# Altium schematic sheet Communication and peripherals.SchDoc
size A4
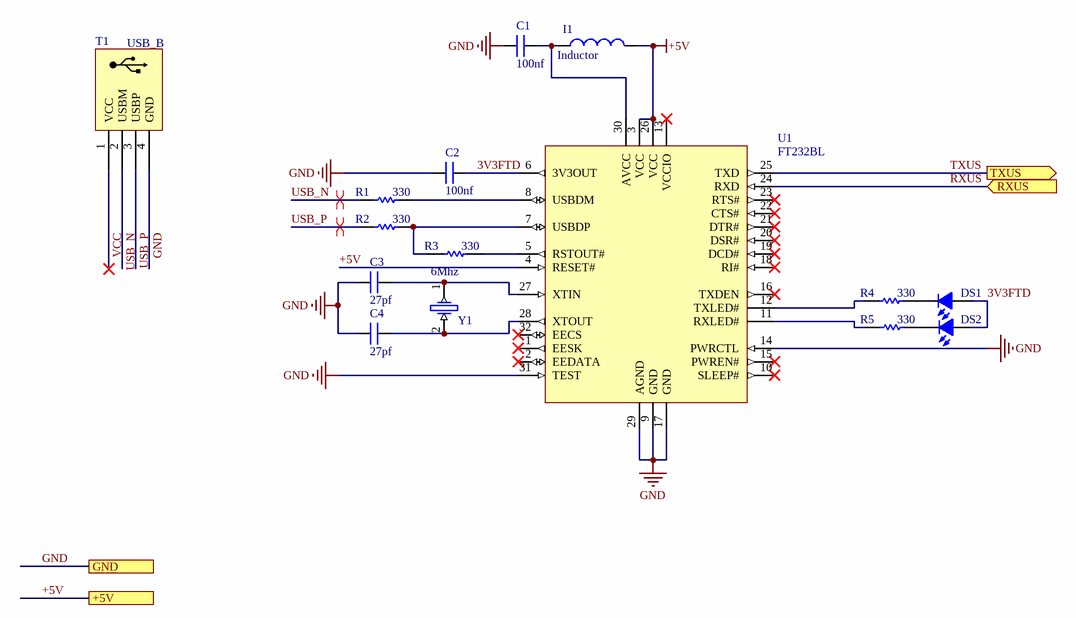
[diagram p0: Communication and peripherals.SchDoc]

## Parts
C1  100nf  [Cap0805]
C2  100nf  [Cap0805]
C3  27pf  [Cap0805]
C4  27pf  [Cap0805]
DS1  LED  [Led0805]  (value not drawn)
DS2  LED  [Led0805]  (value not drawn)
I1  Inductor  [1206]
R1  330  [R0805]
R2  330  [R0805]
R3  330  [R0805]
R4  330  [R0805]
R5  330  [R0805]
T1  USB_B  [USB_Dip_R]
U1  FT232BL  [LQFP-32_L]
Y1  6Mhz  [CrystallB]

## Ports
+5V, GND, RXUS (in), TXUS (out)

## Nets
+5V: I1.2 U1.3(VCC) U1.4(RESET#) U1.26(VCC) ; port +5V
GND: C1.2 C2.2 C3.1 C4.1 T1.4(GND) U1.9(GND) U1.14(PWRCTL) U1.17(GND) U1.29(AGND) U1.31(TEST) ; port GND
3V3FTD: C2.1 DS1.A DS2.A U1.6(3V3OUT)
RXUS: U1.24(RXD) ; port RXUS
TXUS: U1.25(TXD) ; port TXUS
USB_N: R1.1 T1.2(USBM)
USB_P: R2.1 T1.3(USBP)
VCC: T1.1(VCC)
NetC1_1: C1.1 I1.1 U1.30(AVCC)
NetC3_2: C3.2 U1.27(XTIN) Y1.1
NetC4_2: C4.2 U1.28(XTOUT) Y1.2
NetDS1_K: DS1.K R4.2
NetDS2_K: DS2.K R5.2
NetR1_2: R1.2 U1.8(USBDM)
NetR2_2: R2.2 R3.1 U1.7(USBDP)
NetR3_2: R3.2 U1.5(RSTOUT#)
NetR4_1: R4.1 U1.12(TXLED#)
NetR5_1: R5.1 U1.11(RXLED#)

Not connected (* = marked no-connect by the designer): U1 1(EESK)* 2(EEDATA)* 10(SLEEP#)* 13(VCCIO)* 15(PWREN#)* 16(TXDEN)* 18(RI#)* 19(DCD#)* 20(DSR#)* 21(DTR#)* 22(CTS#)* 23(RTS#)* 32(EECS)*

## Layout directives
differential pair: USB_N, USB_P

## Notes on the sheet
- Title
- Size:
- Data:
- CompanyName:
- A4
- Number:
- Time:
- Revision:
- Engineer:
- File:

## Library data of the parts
C1-C4 = Cap: Surface mount Capacitor
I1 = Inductor: Indicator
R1-R5 = Resistor
T1 = USB_B: USB B Connector
U1 = FT232BL: USB UART Asynchronous Serial Data Transfer Chip, LQFP-32, Pb-Free; DatasheetVersion: ver 2.2, Nov-2011; PackageVersion: 2010; PackageReference: LQFP-32; PackageDescription: 32-Pin Thin Quad Flat Pack 0.8 mm Pitch; ComponentLink1Description: Manufacturer URL; ComponentLink1URL: http://www.ftdichip.com/; ComponentLink2Description: Datasheet; ComponentLink2URL: http://www.ftdichip.com/Support/Documents/DataSheets/ICs/DS_FT232BL_BQ.pdf
Y1 = Crystal